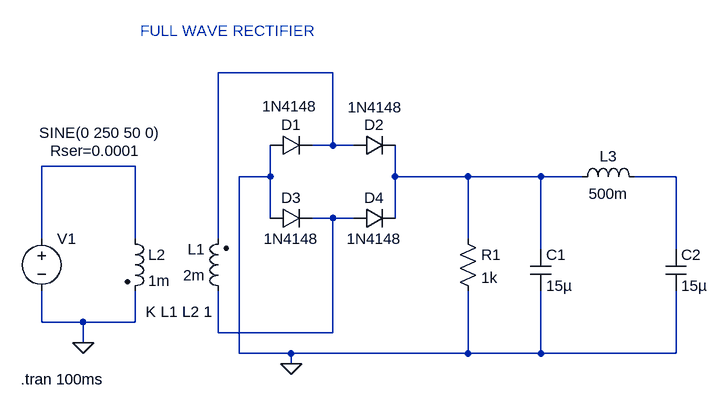
[diagram p0: schematic Pi_Filter.asc]
Pi_Filter.asc, the LTspice schematic file:
Version 4
SHEET 1 880 680
WIRE 208 16 32 16
WIRE 208 128 208 16
WIRE 208 128 176 128
WIRE 240 128 208 128
WIRE -96 160 -240 160
WIRE 112 176 112 128
WIRE 112 176 64 176
WIRE 304 176 304 128
WIRE 416 176 304 176
WIRE 528 176 416 176
WIRE 592 176 528 176
WIRE 736 176 672 176
WIRE 112 240 112 176
WIRE 208 240 176 240
WIRE 240 240 208 240
WIRE 304 240 304 176
WIRE -240 272 -240 160
WIRE -96 272 -96 160
WIRE 32 272 32 16
WIRE 416 272 416 176
WIRE 528 288 528 176
WIRE 736 288 736 176
WIRE -240 400 -240 352
WIRE -176 400 -240 400
WIRE -96 400 -96 352
WIRE -96 400 -176 400
WIRE 32 416 32 352
WIRE 208 416 208 240
WIRE 208 416 32 416
WIRE -176 432 -176 400
WIRE 64 448 64 176
WIRE 144 448 64 448
WIRE 416 448 416 352
WIRE 416 448 144 448
WIRE 528 448 528 352
WIRE 528 448 416 448
WIRE 736 448 736 352
WIRE 736 448 528 448
WIRE 144 464 144 448
FLAG -176 432 0
FLAG 144 464 0
SYMBOL diode 112 144 R270
WINDOW 0 32 32 VTop 2
WINDOW 3 92 30 VBottom 2
SYMATTR InstName D1
SYMATTR Value 1N4148
SYMBOL diode 240 144 R270
WINDOW 0 32 32 VTop 2
WINDOW 3 90 33 VBottom 2
SYMATTR InstName D2
SYMATTR Value 1N4148
SYMBOL diode 112 256 R270
WINDOW 0 32 32 VTop 2
WINDOW 3 0 32 VBottom 2
SYMATTR InstName D3
SYMATTR Value 1N4148
SYMBOL diode 240 256 R270
WINDOW 0 32 32 VTop 2
WINDOW 3 0 32 VBottom 2
SYMATTR InstName D4
SYMATTR Value 1N4148
SYMBOL res 400 256 R0
SYMATTR InstName R1
SYMATTR Value 1k
SYMBOL ind2 -112 256 R0
SYMATTR InstName L2
SYMATTR Value 1m
SYMATTR Type ind
SYMBOL ind2 48 368 R180
WINDOW 0 36 80 Left 2
WINDOW 3 36 40 Left 2
SYMATTR InstName L1
SYMATTR Value 2m
SYMATTR Type ind
SYMBOL voltage -240 256 R0
WINDOW 3 -4 -147 Left 2
WINDOW 123 0 0 Left 0
WINDOW 39 13 -120 Left 2
SYMATTR Value SINE(0 250 50 0)
SYMATTR SpiceLine Rser=0.0001
SYMATTR InstName V1
SYMBOL ind 576 192 R270
WINDOW 0 32 56 VTop 2
WINDOW 3 5 56 VBottom 2
SYMATTR InstName L3
SYMATTR Value 500m
SYMBOL cap 512 288 R0
SYMATTR InstName C1
SYMATTR Value 15µ
SYMBOL cap 720 288 R0
SYMATTR InstName C2
SYMATTR Value 15µ
TEXT -80 384 Left 2 !K L1 L2 1
TEXT -272 488 Left 2 !.tran 100ms
TEXT -88 -48 Left 2 ;FULL WAVE RECTIFIER

The netlist it stands for:
* Pi_Filter.asc
D1 0 N001 1N4148
D2 N001 N003 1N4148
D3 0 N005 1N4148
D4 N005 N003 1N4148
R1 N003 0 1k
L2 N002 0 1m
L1 N005 N001 2m
V1 N002 0 SINE(0 250 50 0) Rser=0.0001
L3 N003 N004 500m
C1 N003 0 15µ
C2 N004 0 15µ
.model D D
.lib standard.dio
K L1 L2 1
.tran 100ms
* FULL WAVE RECTIFIER
.backanno
.end